# EAGLE design Kitchenkopf-v1.1 (EAGLE 7.7.0)
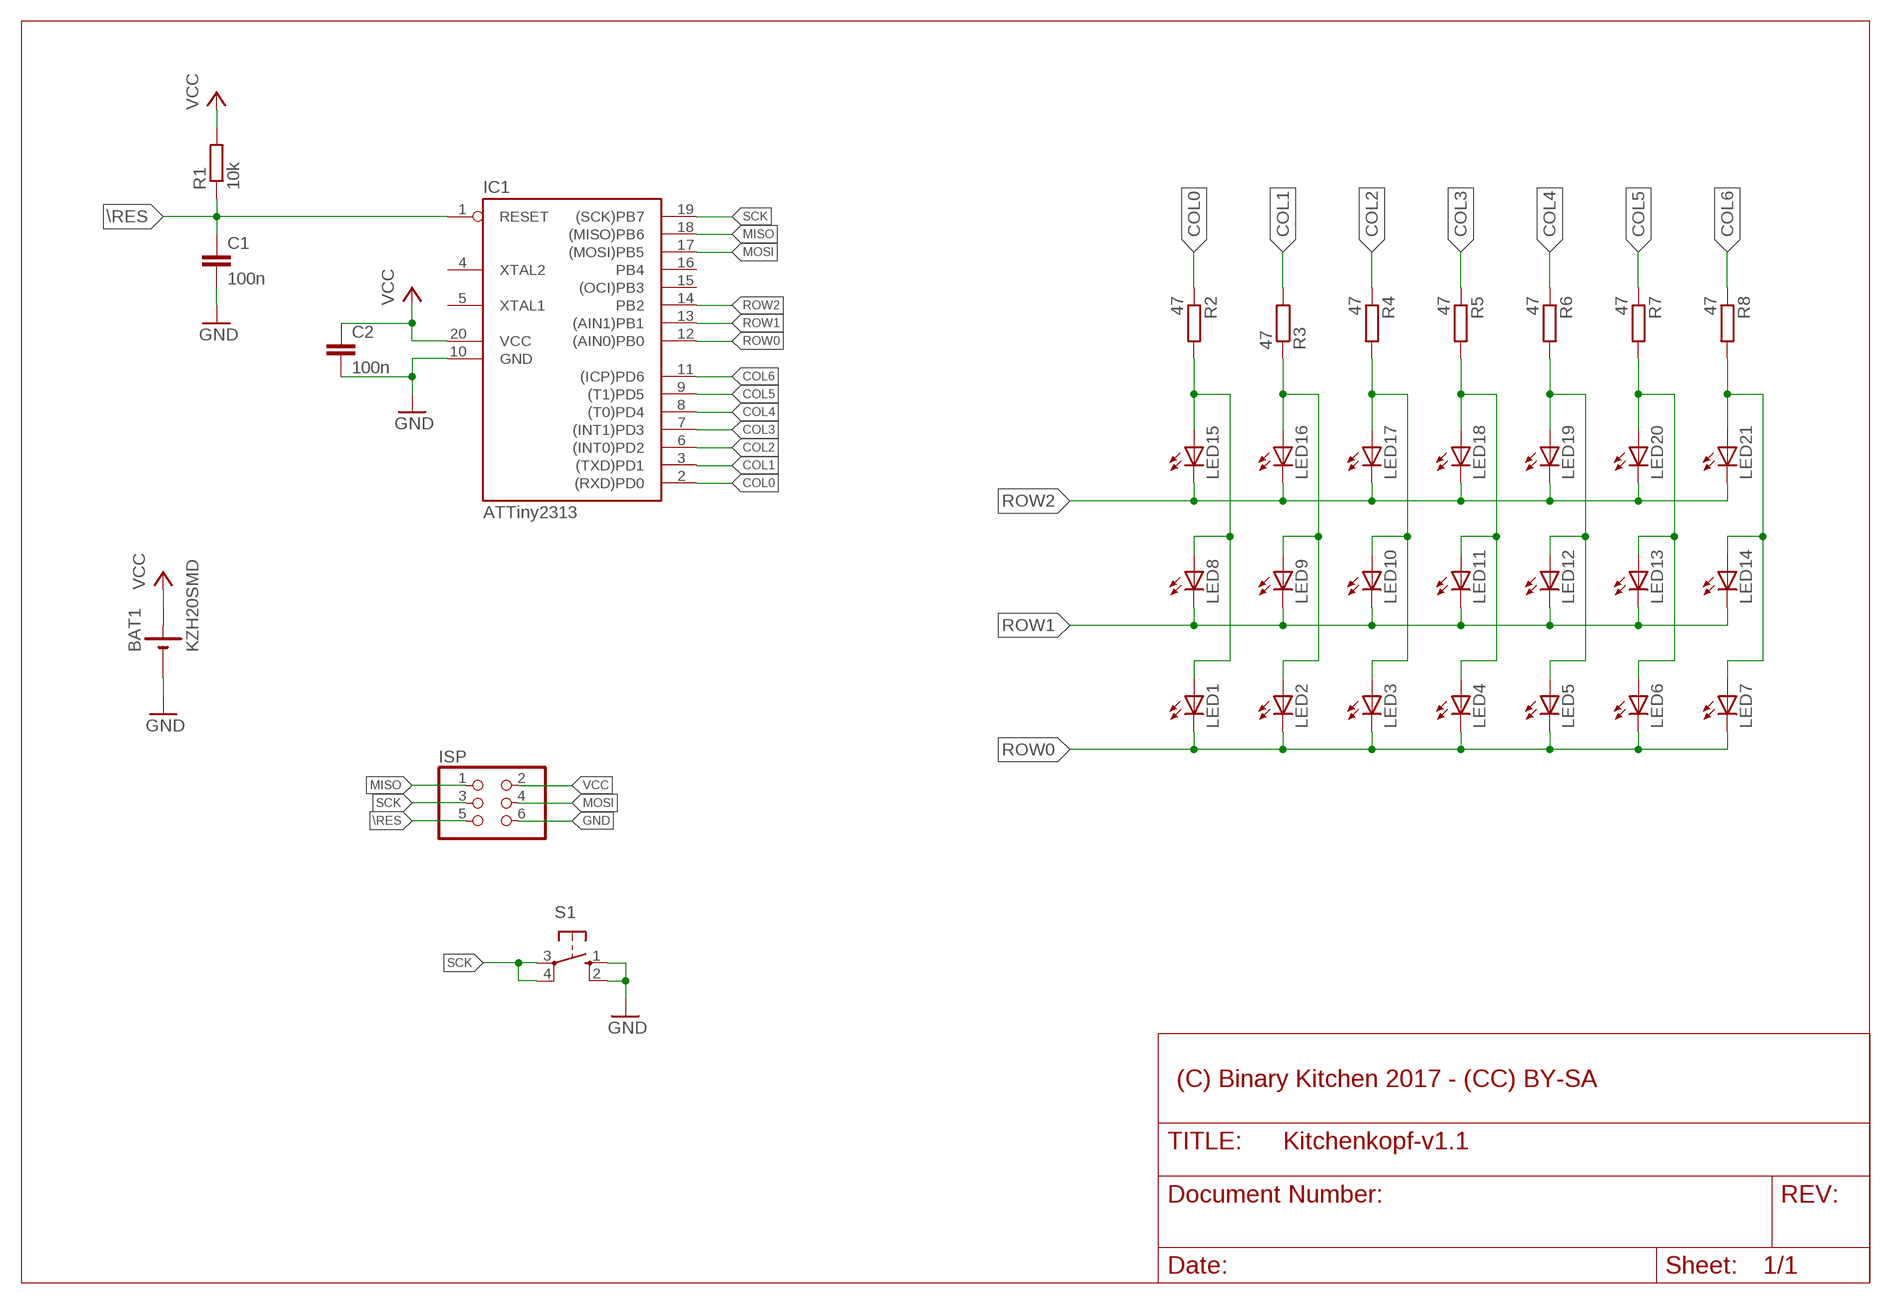
[diagram p0: schematic, sheet 1]

## Parts
BAT1  KZH20SMD  [KZH20SMD]
C1  100n  C-EUC0805  [C0805]
C2  100n  C-EUC0805  [C0805]
IC1  ATTiny2313  AT90S2313S  [SO20L]
ISP  PINHD-2X03_2.54  [2X03]
LED1  LEDCHIP-LED0805  [CHIP-LED0805]
LED2  LEDCHIP-LED0805  [CHIP-LED0805]
LED3  LEDCHIP-LED0805  [CHIP-LED0805]
LED4  LEDCHIP-LED0805  [CHIP-LED0805]
LED5  LEDCHIP-LED0805  [CHIP-LED0805]
LED6  LEDCHIP-LED0805  [CHIP-LED0805]
LED7  LEDCHIP-LED0805  [CHIP-LED0805]
LED8  LEDCHIP-LED0805  [CHIP-LED0805]
LED9  LEDCHIP-LED0805  [CHIP-LED0805]
LED10  LEDCHIP-LED0805  [CHIP-LED0805]
LED11  LEDCHIP-LED0805  [CHIP-LED0805]
LED12  LEDCHIP-LED0805  [CHIP-LED0805]
LED13  LEDCHIP-LED0805  [CHIP-LED0805]
LED14  LEDCHIP-LED0805  [CHIP-LED0805]
LED15  LEDCHIP-LED0805  [CHIP-LED0805]
LED16  LEDCHIP-LED0805  [CHIP-LED0805]
LED17  LEDCHIP-LED0805  [CHIP-LED0805]
LED18  LEDCHIP-LED0805  [CHIP-LED0805]
LED19  LEDCHIP-LED0805  [CHIP-LED0805]
LED20  LEDCHIP-LED0805  [CHIP-LED0805]
LED21  LEDCHIP-LED0805  [CHIP-LED0805]
R1  10k  R-EU_R0805  [R0805]
R2  47  R-EU_R0805  [R0805]
R3  47  R-EU_R0805  [R0805]
R4  47  R-EU_R0805  [R0805]
R5  47  R-EU_R0805  [R0805]
R6  47  R-EU_R0805  [R0805]
R7  47  R-EU_R0805  [R0805]
R8  47  R-EU_R0805  [R0805]
S1  10-XX  [B3F-10XX]

## Nets
\RES: C1.1 IC1.1(RESET) ISP.5 R1.1
COL0: IC1.2((RXD)PD0) R2.1
COL1: IC1.3((TXD)PD1) R3.2
COL2: IC1.6((INT0)PD2) R4.1
COL3: IC1.7((INT1)PD3) R5.1
COL4: IC1.8((T0)PD4) R6.1
COL5: IC1.9((T1)PD5) R7.1
COL6: IC1.11((ICP)PD6) R8.1
GND: BAT1.NEG(-) C1.2 C2.2 IC1.10(GND) ISP.6 S1.1(S) S1.2(S1)
MISO: IC1.18((MISO)PB6) ISP.1
MOSI: IC1.17((MOSI)PB5) ISP.4
N$1: LED1.A LED8.A LED15.A R2.2
N$2: LED2.A LED9.A LED16.A R3.1
N$3: LED3.A LED10.A LED17.A R4.2
N$4: LED4.A LED11.A LED18.A R5.2
N$5: LED5.A LED12.A LED19.A R6.2
N$6: LED6.A LED13.A LED20.A R7.2
N$7: LED7.A LED14.A LED21.A R8.2
ROW0: IC1.12((AIN0)PB0) LED1.C LED2.C LED3.C LED4.C LED5.C LED6.C LED7.C
ROW1: IC1.13((AIN1)PB1) LED8.C LED9.C LED10.C LED11.C LED12.C LED13.C LED14.C
ROW2: IC1.14(PB2) LED15.C LED16.C LED17.C LED18.C LED19.C LED20.C LED21.C
SCK: IC1.19((SCK)PB7) ISP.3 S1.3(P) S1.4(P1)
VCC: BAT1.POS(+) C2.1 IC1.20(VCC) ISP.2 R1.2
Unconnected: IC1.4(XTAL2) IC1.5(XTAL1) IC1.15((OCI)PB3) IC1.16(PB4)

## Notes on the sheet
- (C) Binary Kitchen 2017 - (CC) BY-SA

## Library data of the parts
BAT1 = battery:KZH20SMD
C1 C2 = resistor:C-EU: CAPACITOR, European symbol
IC1 = atmel:AT90S2313: MICROCONTROLLER 2 Kbytes FLASH 128 bytes SRAM 128 bytes EEPROM UART; OC_FARNELL: unknown; OC_NEWARK: unknown
ISP = pinhead-2:PINHD-2X03: PIN HEADER
LED1-LED21 = led:LED: LED OSRAM: - CHIPLED LG R971, LG N971, LY N971, LG Q971, LY Q971, LO R971, LY R971 LH N974, LH R974 LS Q976, LO Q976, LY Q976 LO Q996 - Hyper CHIPLED LW Q18S LB Q993, LB Q99A, LB R99A - SideLED LS A670, LO A670, LY A670, LG A670, LP A670 LB A673, LV A673, LT A673, LW A673 LH A674 LY A675 LS A676, LA A676, LO A676, LY A676, LW A676 LS A679, LY A679, LG A679 - Hyper Micro SIDELED® LS Y876, LA Y876, LO Y876, LY Y876 LT Y87S - SmartLED LW L88C, LW L88S LB L89C, LB L89S, LG L890 LS L89K, LO L89K, LY L89K LS L896, LA L896, LO L896, LY L896 - TOPLED LS T670, LO T670, LY T670, LG T670, LP T670 LSG T670, LSP T670, LSY T670, LOP T670, LYG T670 LG T671, LOG T671, LSG T671 LB T673, LV T673, LT T673, LW T673 LH T674 LS T676, LA T676, LO T676, LY T676, LB T676, LH T676, LSB T676, LW T676 LB T67C, LV T67C, LT T67C, LS T67K, LO T67K, LY T67K, LW E67C LS E67B, LA E67B, LO E67B, LY E67B, LB E67C, LV E67C, LT E67C LW T67C LS T679, LY T679, LG T679 LS T770, LO T770, LY T770, LG T770, LP T770 LB T773, LV T773, LT T773, LW T773 LH T774 LS E675, LA E675, LY E675, LS T675 LS T776, LA T776, LO T776, LY T776, LB T776 LHGB T686 LT T68C, LB T68C - Hyper Mini TOPLED® LB M676 - Mini TOPLED Santana® LG M470 LS M47K, LO M47K, LY M47K Source: http://www.osram.convergy.de LUXEON: - LUMILED® LXK2-PW12-R00, LXK2-PW12-S00, LXK2-PW14-U00, LXK2-PW14-V00 LXK2-PM12-R00, LXK2-PM12-S00, LXK2-PM14-U00 LXK2-PE12-Q00, LXK2-PE12-R00, LXK2-PE12-S00, LXK2-PE14-T00, LXK2-PE14-U00 LXK2-PB12-K00, LXK2-PB12-L00, LXK2-PB12-M00, LXK2-PB14-N00, LXK2-PB14-P00, LXK2-PB14-Q00 LXK2-PR12-L00, LXK2-PR12-M00, LXK2-PR14-Q00, LXK2-PR14-R00 LXK2-PD12-Q00, LXK2-PD12-R00, LXK2-PD12-S00 LXK2-PH12-R00, LXK2-PH12-S00 LXK2-PL12-P00, LXK2-PL12-Q00, LXK2-PL12-R00 Source: www.luxeon.com KINGBRIGHT: KA-3528ASYC Source: www.kingbright.com
R1-R8 = resistor:R-EU_: RESISTOR, European symbol
S1 = switch-omron:10-XX: OMRON SWITCH; MPN: B3F-1000; OC_FARNELL: 176432; OC_NEWARK: 36M3542

## Board
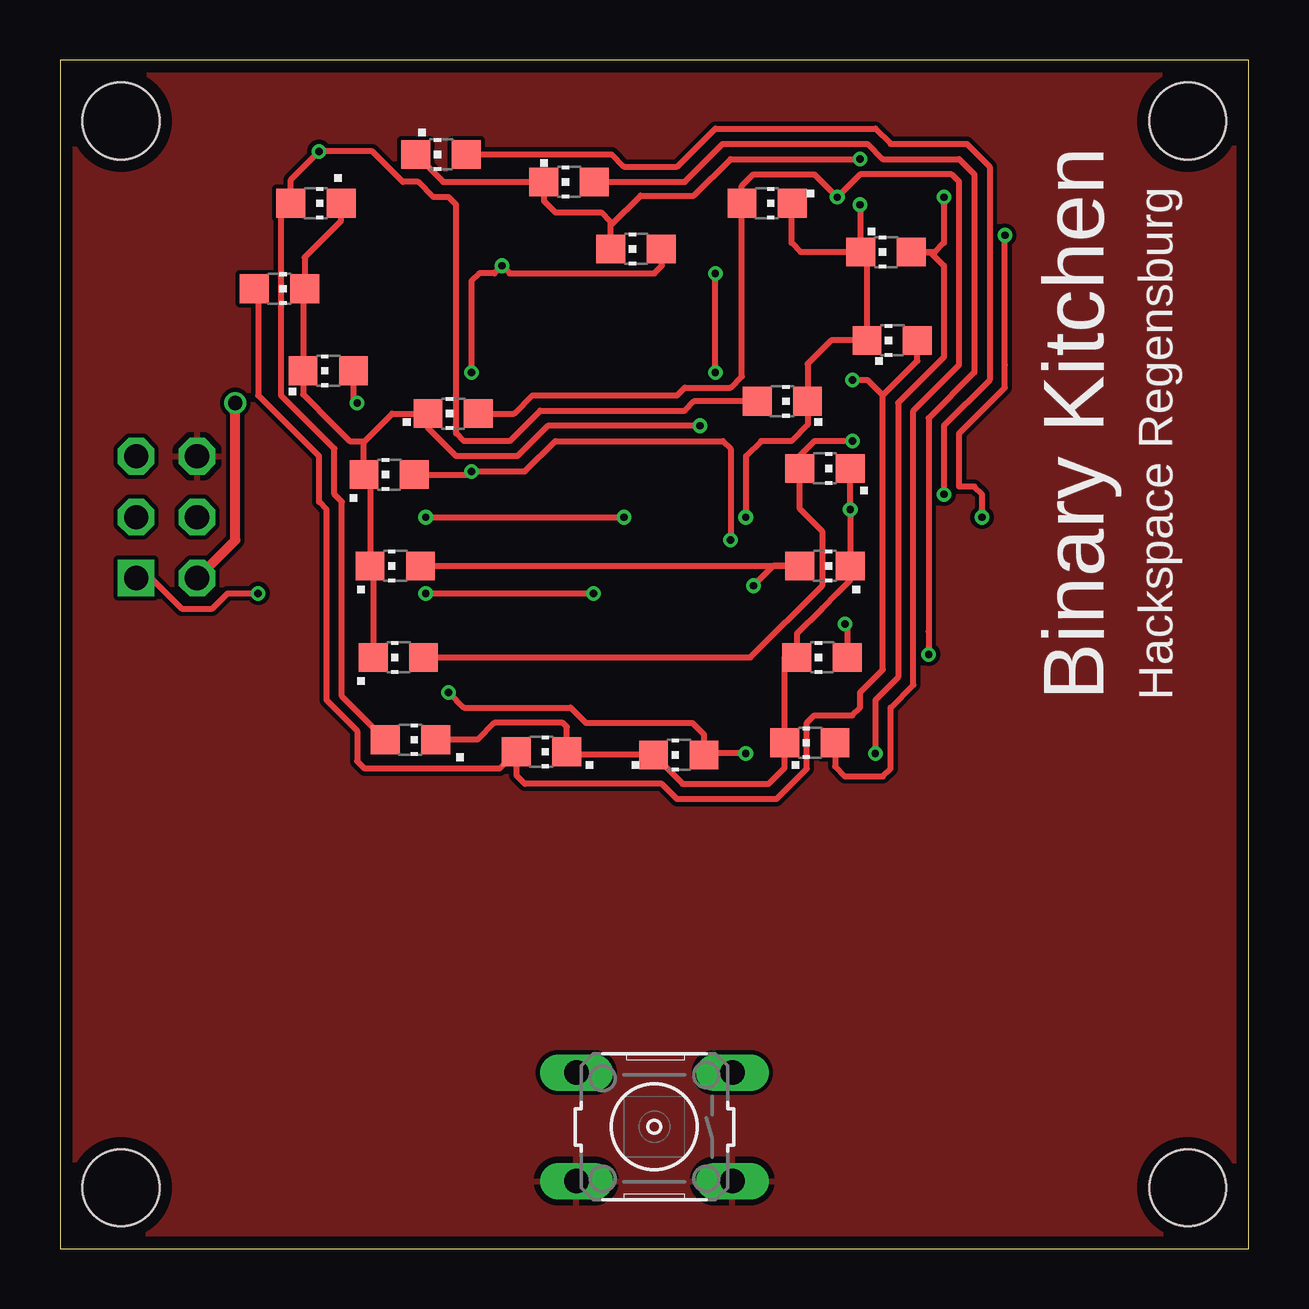
[diagram p1: board, top side]
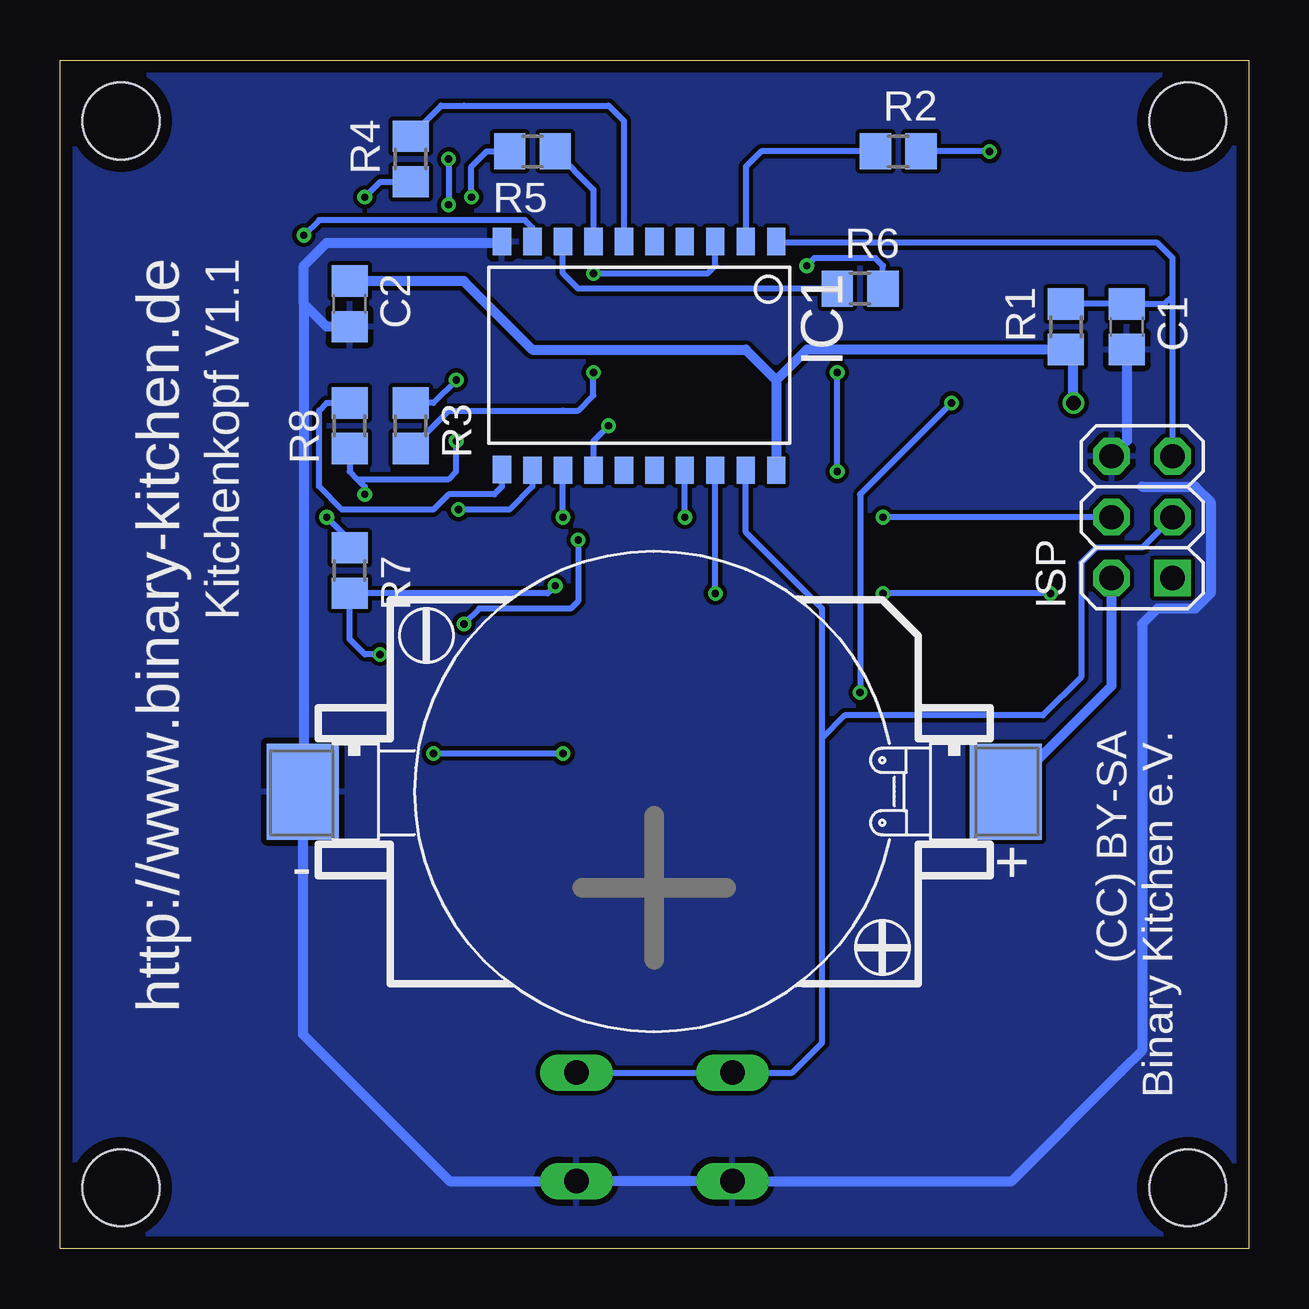
[diagram p2: board, bottom side, seen from below]

Size 49.53 x 49.53 mm. Coordinates in mm from the lower left corner, seen from the top.
Outline: 0,0 49.53,0 49.53,49.53 0,49.53 0,0
Copper layers (1*16): Top 0.035mm / dielectric 1.5mm / Bottom 0.035mm
Design rules "SmartPrototyping": minimum track width 7mil, minimum drill 12mil, track to track 7mil, track to pad 7mil, pad to pad 7mil, via to via 7mil, smd to smd 0mil, copper to edge 20mil, drill to drill 10mil, minimum pad ring 10mil, minimum via ring 6mil, stop-mask expansion 2mil, vias tented up to drill 25mil, thermal gap 10mil
Holes 3.2 mm at 46.99,46.99 2.54,2.54 2.54,46.99 46.99,2.54

### Footprints (pad centres in the part's own frame; a part is rotated, then mirrored left to right if it is on the bottom)
KZH20SMD = smd 3 x 4: NEG -14.65,0; POS 14.65,0
C0805 = smd 1.3 x 1.5: 1 -0.95,0; 2 0.95,0
SO20L = smd 0.762 x 1.143: 1 -5.08,-5.131; 2 -3.81,-5.131; 3 -2.54,-5.131; 4 -1.27,-5.131; 5 0,-5.131; 6 1.27,-5.131; 7 2.54,-5.131; 8 3.81,-5.131; 9 5.08,-5.131; 10 6.35,-5.131; 11 6.35,4.369; 12 5.08,4.394; 13 3.81,4.394; 14 2.54,4.394; 15 1.27,4.394; 16 0,4.394; 17 -1.27,4.394; 18 -2.54,4.394; 19 -3.81,4.394; 20 -5.08,4.394
2X03 = drill 1.016 square: 1 -2.54,-1.27 | drill 1.016 octagon: 2 -2.54,1.27; 3 0,-1.27; 4 0,1.27; 5 2.54,-1.27; 6 2.54,1.27
CHIP-LED0805 = smd 1.2 x 1.2: A 0,-1.05; C 0,1.05
R0805 = smd 1.3 x 1.5: 1 -0.95,0; 2 0.95,0
B3F-10XX = drill 1.016 long: 1 -3.251,2.261; 2 3.251,2.261; 3 -3.251,-2.261; 4 3.251,-2.261

### Placement (x,y rotation side)
BAT1  24.77,19.05 0 bottom
C1  5.08,38.42 270 bottom
C2  37.47,39.37 270 bottom
IC1  24.77,36.83 180 bottom
ISP  4.45,30.48 90 bottom
LED1  14.61,21.21 270 top
LED2  20.07,20.7 270 top
LED3  25.78,20.57 90 top
LED4  31.24,21.08 90 top
LED5  31.75,24.64 90 top
LED6  31.88,28.45 270 top
LED7  31.88,32.51 270 top
LED8  30.1,35.31 270 top
LED9  34.67,37.85 90 top
LED10  34.42,41.53 90 top
LED11  29.46,43.56 270 top
LED12  24,41.66 90 top
LED13  21.21,44.45 90 top
LED14  15.88,45.59 90 top
LED15  10.67,43.56 270 top
LED16  9.14,40.01 270 top
LED17  11.18,36.58 90 top
LED18  16.38,34.8 90 top
LED19  13.72,32.26 90 top
LED20  13.97,28.45 90 top
LED21  14.1,24.64 90 top
R1  7.62,38.42 270 bottom
R2  14.61,45.72 0 bottom
R3  34.92,34.29 270 bottom
R4  34.92,45.4 270 bottom
R5  29.84,45.72 180 bottom
R6  16.19,40.01 0 bottom
R7  37.47,28.26 270 bottom
R8  37.47,34.29 270 bottom
S1  24.77,5.08 180 top

### Tracks (layer width: path | path; a pad name or v marks a point on that pad's centre or on a via)
\RES
  Bottom 0.254: 3.17,39.69 3.17,41.27 3.81,41.91 19.63,41.91 | 3.17,39.69 3.5,39.37 C1.1 R1.1 | ISP.5 3.17,39.69
  Bottom 0.406: 19.63,41.91 IC1.1
COL0
  Bottom 0.254: R2.1 20.32,45.72 20.95,45.09 IC1.2
COL1  (via drill 0.3)
  Top 0.254: v27.3,36.51 v27.3,40.64
  Bottom 0.254: R3.2 33.34,34.92 28.57,34.92 27.94,34.92 27.3,35.56 v27.3,36.51 | v27.3,40.64 22.54,40.64 22.23,40.96 IC1.3
COL2
  Bottom 0.254: IC1.6 26.04,46.99 26.67,47.62 32.7,47.62 33.65,47.62 R4.1
COL3
  Bottom 0.254: R5.1 27.3,44.13 IC1.7
COL4
  Bottom 0.254: R6.1 27.94,40.01 28.57,40.64 IC1.8
COL5  (via drill 0.3)
  Top 0.254: v38.42,30.48 38.42,31.43 38.1,31.75 37.47,31.75 37.47,33.97 39.37,35.88 39.37,36.83 v39.37,42.23
  Bottom 0.254: IC1.9 29.84,42.55 30.16,42.86 38.73,42.86 v39.37,42.23 | R7.1 37.47,29.53 v38.42,30.48
COL6
  Bottom 0.254: IC1.11 31.11,31.75 31.43,31.43 33.34,31.43 33.66,31.11 33.97,30.8 37.78,30.8 38.73,31.75 38.73,34.92 38.42,35.24 R8.1
GND
  Bottom 0.406: C2.2 38.42,38.42 39.37,39.37 | 39.37,39.37 39.37,40.96 39.05,41.27 38.42,41.91 31.17,41.91 IC1.10 | 5.36,7.34 5.24,7.46 | 5.24,7.46 4.45,8.26 4.45,26.04 3.81,26.67 2.22,26.67 1.59,27.3 1.59,31.11 2.22,31.75 4.45,31.75 | C1.2 5.08,33.66 | 39.37,39.37 39.37,19.05 BAT1.NEG 39.41,8.94 37.82,7.34 33.3,2.82 S1.1 S1.2 9.88,2.82 5.24,7.46
  pour Bottom: 0.32,0.32 49.21,0.32 49.21,49.21 0.32,49.21
  pour Top: 0.32,49.21 49.21,49.21 49.21,0.32 0.32,0.32
MISO  (via drill 0.3)
  Top 0.254: v8.26,27.3 6.99,27.3 6.35,26.67 5.08,26.67 3.81,27.94 ISP.1 | v15.24,27.3 v22.23,27.3
  Bottom 0.254: v8.26,27.3 v15.24,27.3 | v22.23,27.3 IC1.18
MOSI  (via drill 0.3)
  Top 0.254: v15.24,30.48 v23.5,30.48
  Bottom 0.254: v23.5,30.48 IC1.17 | ISP.4 v15.24,30.48
N$1  (via drill 0.3)
  Top 0.254: LED1.A 11.75,23.02 11.75,31.11 11.43,31.43 11.43,33.34 9.21,35.56 9.21,43.15 arc-90 LED15.A 9.62,44.54 v10.79,45.72 13.02,45.72 13.65,45.09 14.29,44.45 14.92,44.45 15.56,43.81 16.19,43.81 16.51,43.5 16.51,43.18 16.51,33.97 16.83,33.66 18.73,33.66 20,34.92 26.04,34.92 26.42,35.31 LED8.A
  Bottom 0.254: v10.79,45.72 R2.2
N$2  (via drill 0.3)
  Top 0.254: 34.29,35.56 35.72,36.99 LED9.A | 34.29,35.56 33.66,36.2 v33.02,36.2 | 34.29,35.56 34.29,24.13 33.34,23.18 33.34,22.54 33.02,22.23 31.43,22.23 31.11,21.91 31.11,20 29.84,18.73 25.72,18.73 25.08,19.37 19.37,19.37 19.02,19.72 LED2.A 18.32,20 12.7,20 12.38,20.32 12.38,21.59 11.11,22.86 11.11,30.8 10.79,31.11 10.79,33.02 8.26,35.56 8.26,39.84 LED16.A
  Bottom 0.254: v33.02,36.2 33.98,35.24 R3.1
N$3  (via drill 0.3)
  Top 0.254: v36.83,43.81 36.83,43.18 36.83,41.91 36.45,41.53 35.62,41.53 | LED10.A 35.62,41.53 | 35.62,41.53 36.26,41.53 36.83,40.96 36.83,40.32 36.83,37.15 34.92,35.24 34.92,23.81 33.97,22.86 v33.97,20.64 | v28.57,20.64 26.89,20.64 LED3.A 26.83,21.43 26.35,21.91 21.91,21.91 21.27,22.54 16.83,22.54 v16.19,23.18 | LED17.A 12.23,35.4 v12.38,35.24
  Bottom 0.254: v33.97,20.64 v28.57,20.64 | v12.38,35.24 16.19,31.43 v16.19,23.18 | v36.83,43.81 36.19,44.45 R4.2
N$4  (via drill 0.3)
  Top 0.254: LED4.A 32.29,20.1 32.7,19.68 34.29,19.68 34.61,20 34.61,22.54 35.56,23.5 35.56,34.92 37.47,36.83 37.47,44.45 37.15,44.77 33.34,44.77 v32.38,43.81 31.43,44.77 28.89,44.77 28.41,44.29 LED11.A 28.41,36.35 27.94,35.88 26.04,35.88 25.72,35.56 19.68,35.56 18.92,34.8 LED18.A
  Bottom 0.254: v32.38,43.81 32.38,45.09 31.75,45.72 R5.2
N$5  (via drill 0.3)
  Top 0.254: LED19.A 17.14,32.26 v17.14,32.38 19.37,32.38 20.64,33.66 27.62,33.66 27.94,33.34 v27.94,29.53 | v17.14,36.51 17.14,40.32 17.46,40.64 18.1,40.64 v18.41,40.96 18.73,40.64 24.77,40.64 25.08,40.96 25.08,41.63 LED12.A | v32.7,26.04 32.8,25.94 LED5.A
  Bottom 0.254: R6.2 15.24,40.95 arc90 15.24,40.96 15.56,41.27 18.1,41.27 v18.41,40.96 | v17.14,32.38 v17.14,36.51 | v27.94,29.53 27.94,26.99 28.26,26.67 32.07,26.67 v32.7,26.04
N$6  (via drill 0.3)
  Top 0.254: LED20.A LED6.A 29.72,28.45 v28.89,27.62 | LED13.A 26.04,44.45 27.62,46.04 33.66,46.04 34.29,45.4 37.47,45.4 38.1,44.77 38.1,36.51 36.2,34.61 36.2,25.72 v36.2,24.77
  Bottom 0.254: v28.89,27.62 29.21,27.3 R7.2 37.47,25.4 36.83,24.77 v36.2,24.77
N$7  (via drill 0.3)
  Top 0.254: LED21.A 28.77,24.64 31.75,27.62 31.75,29.9 30.83,30.83 LED7.A 30.83,33.05 31.43,33.66 v33.02,33.66 | LED14.A 22.99,45.59 23.5,45.09 25.72,45.09 27.3,46.67 33.97,46.67 34.61,46.04 37.78,46.04 38.73,45.09 38.73,36.2 36.83,34.29 v36.83,31.43
  Bottom 0.254: R8.2 37.47,32.38 37.15,32.07 | 37.15,32.07 33.34,32.07 33.02,32.38 v33.02,33.66 | v36.83,31.43 36.83,31.75 37.15,32.07
ROW0  (via drill 0.3)
  Top 0.254: 21.24,20.57 LED3.C 25.94,19.37 29.53,19.37 30.19,20.03 LED4.C 30.19,24.64 LED5.C 30.7,25.62 31.75,26.67 32.38,27.3 32.93,27.85 LED6.C v32.93,30.8 LED7.C | LED2.C 21.12,21.75 20.95,21.91 18.1,21.91 17.4,21.21 LED1.C
  Top 0.406: 21.24,20.57 LED2.C
  Bottom 0.254: IC1.12 29.84,31.75 30.8,30.8 v32.93,30.8
ROW1  (via drill 0.3)
  Top 0.254: LED14.C 15.97,44.45 LED13.C 20.16,43.66 20.64,43.18 22.54,43.18 22.95,42.77 LED12.C 22.95,42.64 24.19,43.88 26.42,43.88 27.94,45.4 v33.34,45.4 | 33.62,41.53 LED9.C 32.13,37.85 31.15,36.86 LED8.C 31.15,34.32 30.48,33.66 29.21,33.66 28.57,33.02 v28.57,30.48 | LED11.C 30.48,43.53 30.48,41.91 30.86,41.53 LED10.C 33.34,41.53 v33.34,43.5
  Top 0.406: LED10.C 33.62,41.53
  Bottom 0.254: v28.57,30.48 IC1.13 | v33.34,45.4 v33.34,43.5
ROW2  (via drill 0.3)
  Top 0.254: LED19.C 12.67,33.62 12.7,33.66 | 12.7,33.66 13.84,34.8 LED18.C 15.33,34.2 16.51,33.02 19.05,33.02 20.32,34.29 v26.67,34.29 | 12.92,32 LED20.C | 13.05,28.32 LED21.C | LED15.C 11.72,42.83 10.19,41.31 LED16.C 10.13,39.94 LED17.C 10.13,36.16 10.13,35.59 11.43,34.29 12.06,33.66 12.7,33.66
  Top 0.406: LED19.C arc-90 12.92,32 | LED20.C arc-90 13.05,28.32
  Bottom 0.254: v26.67,34.29 27.3,33.66 IC1.14
SCK
  Bottom 0.254: 17.78,21.27 17.78,8.57 19.01,7.34 S1.4 S1.3 | 17.78,21.27 17.78,26.67 20.95,29.84 IC1.19 | 17.78,21.27 16.83,22.23 8.57,22.23 6.99,23.81 6.99,28.57 6.35,29.21 4.45,29.21 ISP.3
VCC  (via drill 0.6)
  Top 0.406: v7.3,35.24 7.3,29.53 ISP.2
  Bottom 0.406: BAT1.POS 5.71,23.45 ISP.2 | 19.68,36.2 20.95,37.47 29.84,37.47 32.7,40.32 C2.1 | 19.68,36.2 IC1.20 | 19.68,36.2 18.41,37.47 R1.2 arc90 7.3,37.15 v7.3,35.24

### Text on the board
tNames: Binary Kitchen | Hackspace Regensburg
bNames: Kitchenkopf V1.1 | http://www.binary-kitchen.de | (CC) BY-SA / Binary Kitchen e.V. | + | -